# EAGLE design homecomputer-6502 (EAGLE 6.5.0)
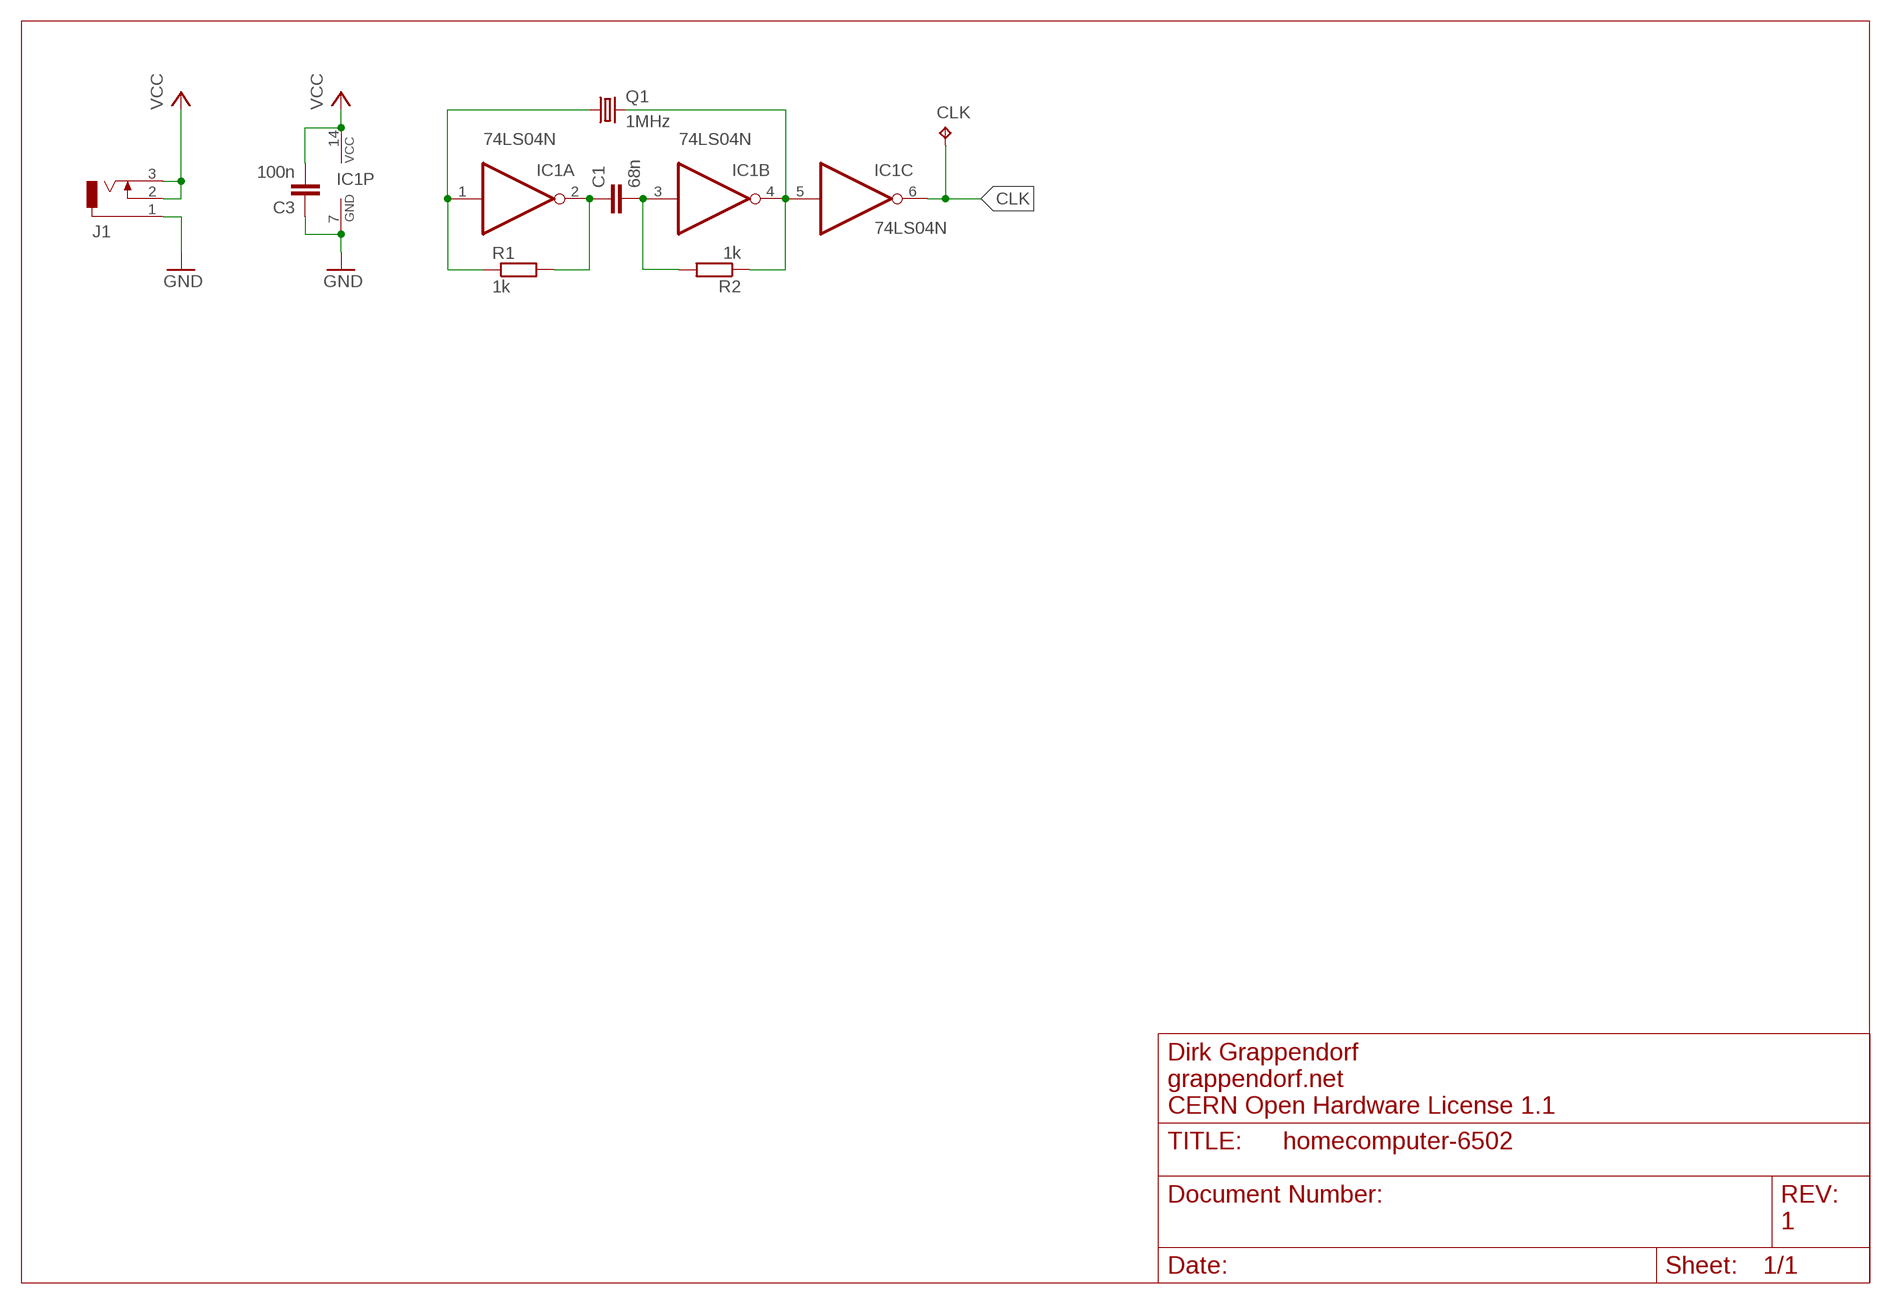
[diagram p0: schematic, sheet 1]

## Parts
C1  68n  C-EU025-024X044  [C025-024X044]
C3  100n  C-EU025-024X044  [C025-024X044]
CLK  TPTP15SQ  [TP15SQ]
IC1  74LS04N  [DIL14]
J1  DCJ0303  [DCJ0303]
Q1  1MHz  CRYSTALHC49U-V  [HC49U-V]
R1  1k  R-EU_0204/5  [0204/5]
R2  1k  R-EU_0204/5  [0204/5]

## Nets
CLK: CLK.TP IC1.6(C:O)
GND: C3.1 IC1.7(P:GND) J1.1
N$1: IC1.1(A:I) Q1.1 R1.1
N$2: C1.1 IC1.2(A:O) R1.2
N$7: C1.2 IC1.3(B:I) R2.2
N$8: IC1.4(B:O) IC1.5(C:I) Q1.2 R2.1
VCC: C3.2 IC1.14(P:VCC) J1.2 J1.3
Unconnected: IC1.8(D:O) IC1.9(D:I) IC1.10(E:O) IC1.11(E:I) IC1.12(F:O) IC1.13(F:I)

## Notes on the sheet
- Dirk Grappendorf
- grappendorf.net
- CERN Open Hardware License 1.1
- 1

## Library data of the parts
C1 C3 = rcl:C-EU: CAPACITOR, European symbol
CLK = testpad:TP: Test pad
IC1 = 74xx-eu:74*04: Hex INVERTER
J1 = con-jack:DCJ0303: DC POWER JACK Source: DCJ0303.pdf; OC_FARNELL: unknown; OC_NEWARK: unknown
Q1 = crystal:CRYSTAL: CRYSTAL; OC_FARNELL: 1666969; OC_NEWARK: unknown
R1 R2 = rcl:R-EU_: RESISTOR, European symbol

## Board
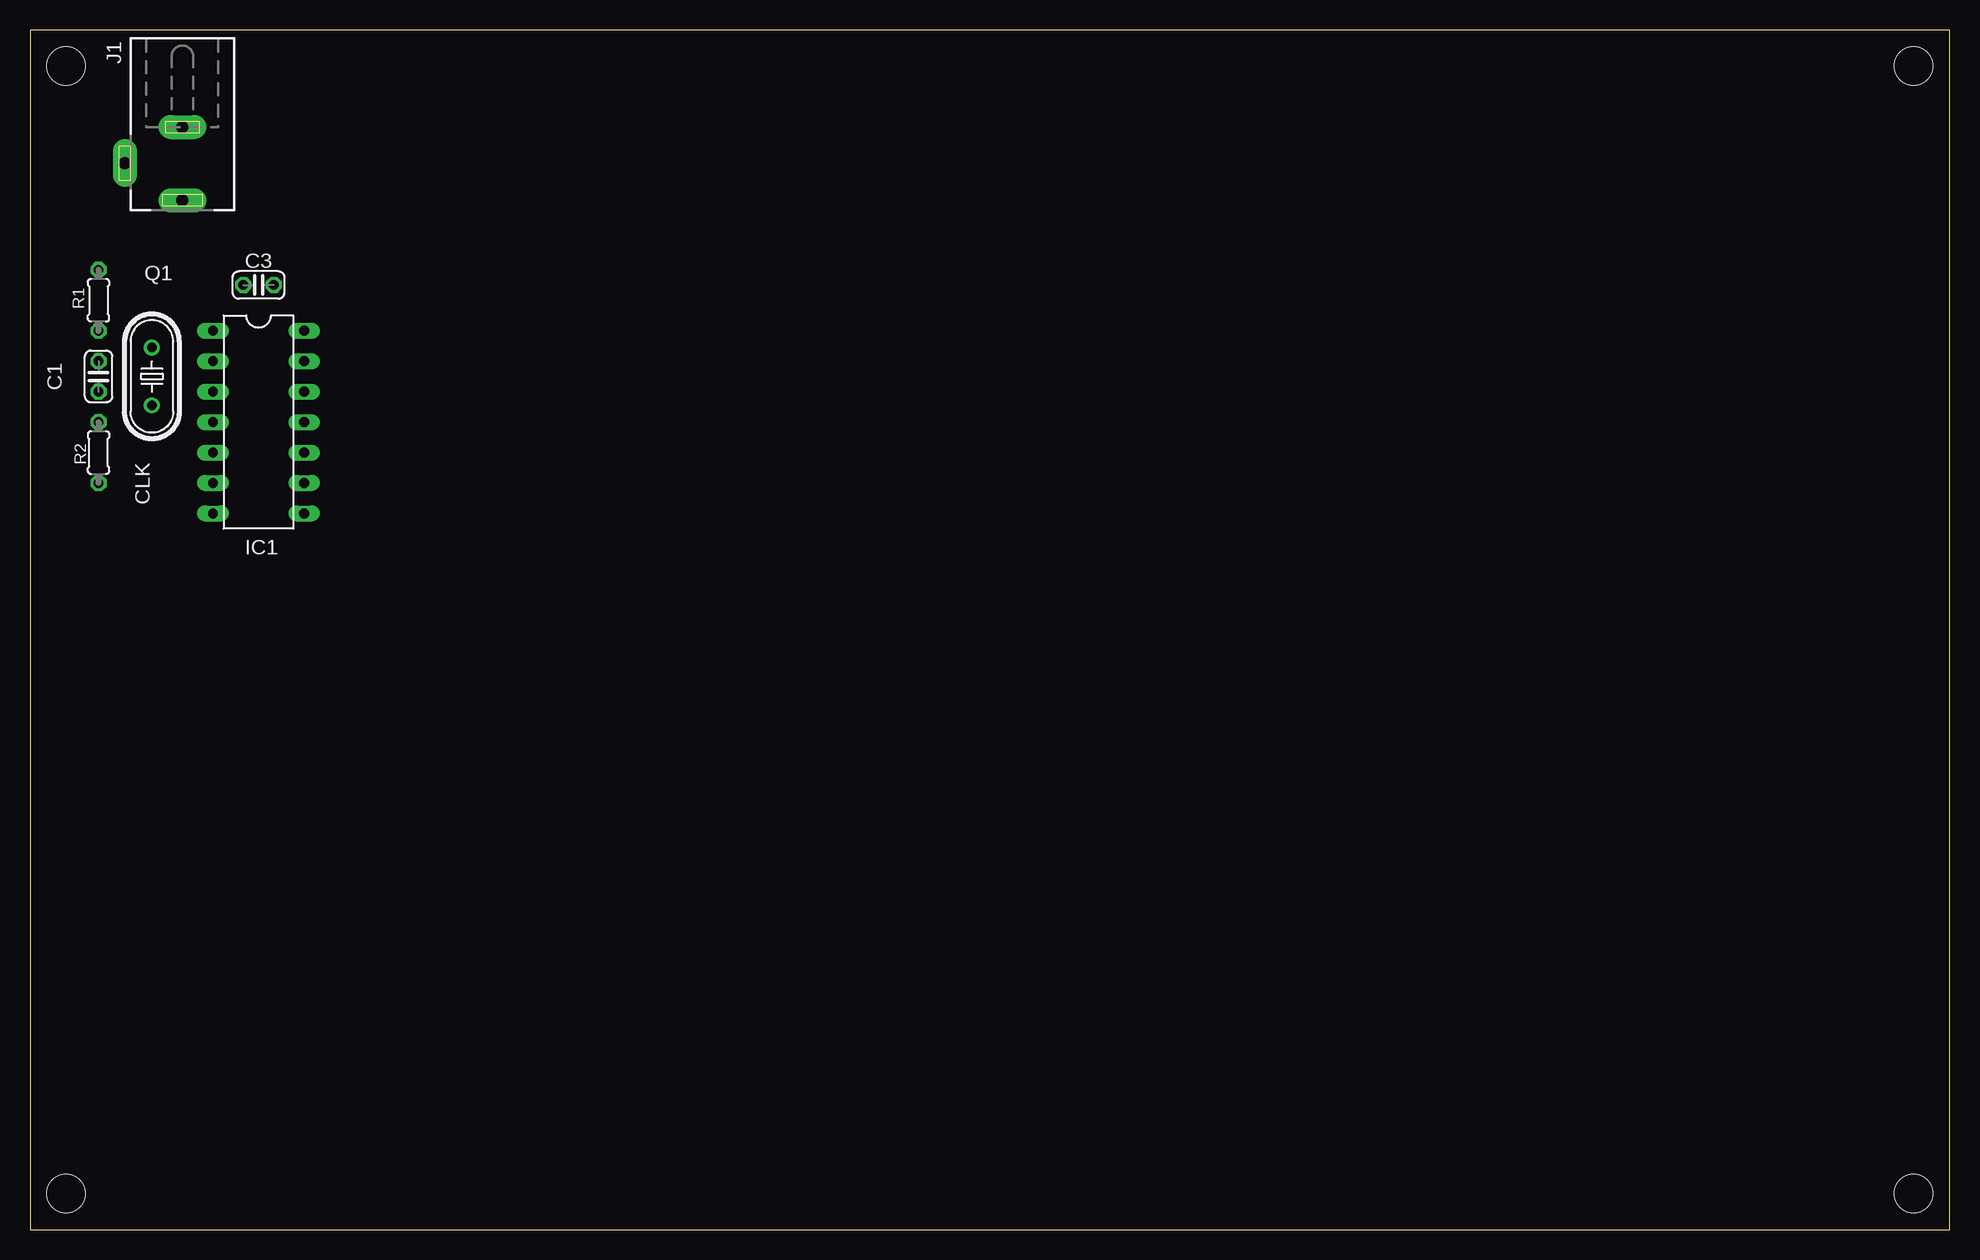
[diagram p1: board, top side]
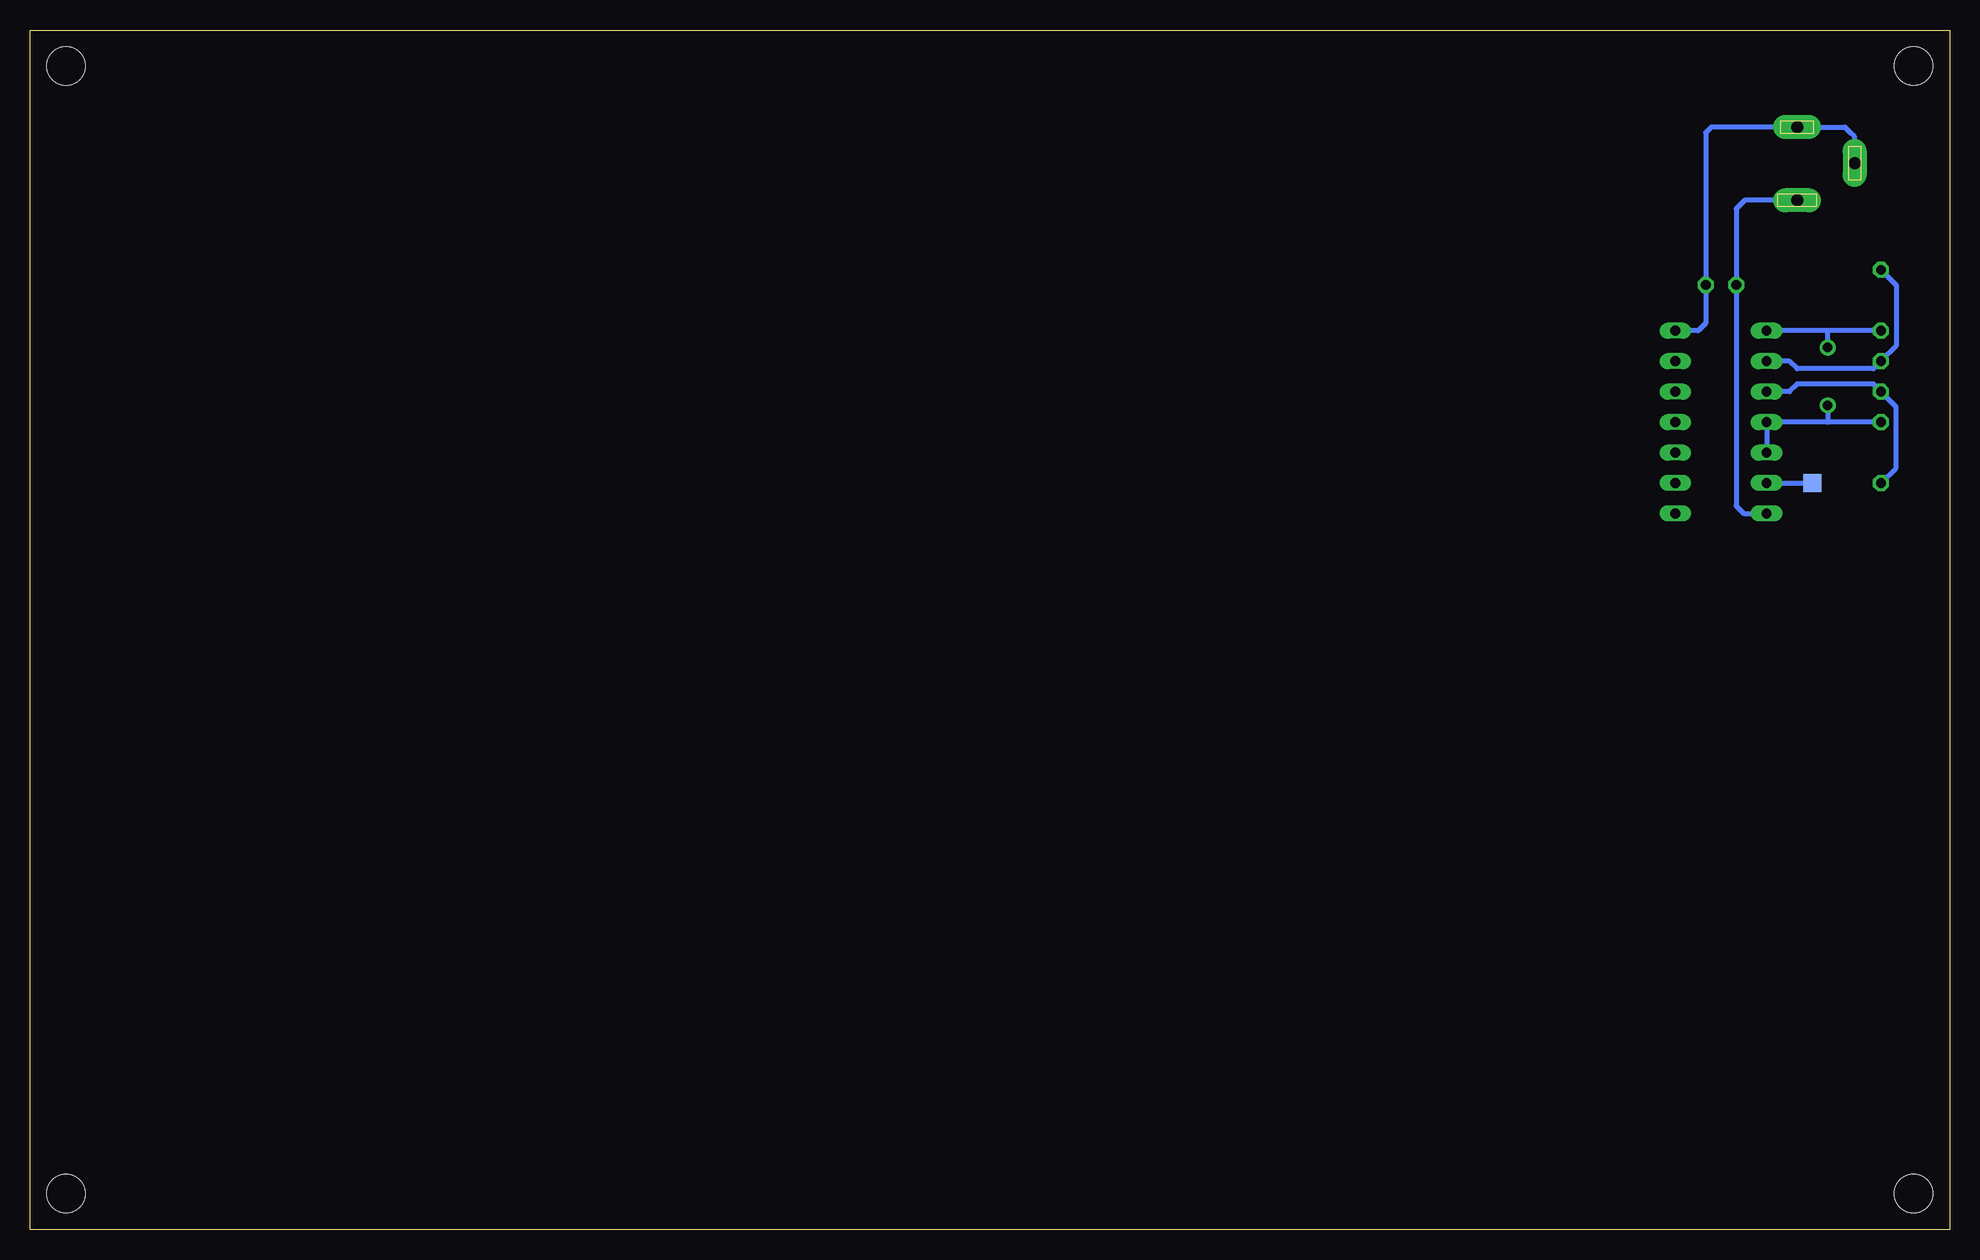
[diagram p2: board, bottom side, seen from below]

Size 160 x 100 mm. Coordinates in mm from the lower left corner, seen from the top.
Outline: 0,0 160,0 160,100 0,100 0,0
Copper layers (1*16): Top 0.035mm / dielectric 1.5mm / Bottom 0.035mm
Design rules "default": minimum track width 10mil, minimum drill 24mil, track to track 8mil, track to pad 8mil, pad to pad 8mil, via to via 8mil, smd to smd 8mil, copper to edge 40mil, drill to drill 8mil, minimum pad ring 10mil, minimum via ring 8mil, stop-mask expansion 4mil, vias tented up to drill 0mil, thermal gap 10mil
Holes 3.2 mm at 3,97 157,97 3,3 157,3

### Footprints (pad centres in the part's own frame; a part is rotated, then mirrored left to right if it is on the bottom)
C025-024X044 = drill 0.813 octagon: 1 -1.27,0; 2 1.27,0
TP15SQ = smd 1.5 x 1.5: TP 0,0
DIL14 = drill 0.813 long: 1 -7.62,-3.81; 2 -5.08,-3.81; 3 -2.54,-3.81; 4 0,-3.81; 5 2.54,-3.81; 6 5.08,-3.81; 7 7.62,-3.81; 8 7.62,3.81; 9 5.08,3.81; 10 2.54,3.81; 11 0,3.81; 12 -2.54,3.81; 13 -5.08,3.81; 14 -7.62,3.81
DCJ0303 = drill 1 pad 2 long: 1 0,3.1; 2 4.8,0; 3 0,-3
HC49U-V = drill 0.813: 1 -2.413,0; 2 2.413,0
0204/5 = drill 0.813 octagon: 1 -2.54,0; 2 2.54,0

### Placement (x,y rotation side)
C1  5.71,71.12 270 top
C3  19.05,78.74 0 top
CLK  11.43,62.23 0 bottom
IC1  19.05,67.31 270 top
J1  12.7,88.9 180 top
Q1  10.16,71.12 270 top
R1  5.71,77.47 90 top
R2  5.71,64.77 270 top

### Tracks (layer width: path | path; a pad name or v marks a point on that pad's centre or on a via)
CLK
  Bottom 0.406: IC1.6 CLK.TP
GND
  Bottom 0.406: IC1.7 17.14,59.69 17.78,60.33 C3.1 17.78,85.09 17.07,85.8 J1.1
N$1
  Bottom 0.406: R1.1 10.16,74.93 | 10.16,74.93 IC1.1 | Q1.1 10.16,74.93
N$2
  Bottom 0.406: IC1.2 13.34,72.39 12.7,71.75 6.35,71.75 C1.1 4.45,73.66 4.45,78.74 R1.2
N$7
  Bottom 0.406: IC1.3 13.34,69.85 12.7,70.48 6.35,70.48 C1.2 4.45,68.58 4.45,63.5 R2.2
N$8
  Bottom 0.406: IC1.5 IC1.4 10.16,67.31 | R2.1 10.16,67.31 | Q1.2 10.16,67.31
VCC
  Bottom 0.406: IC1.14 20.95,74.93 20.32,75.56 C3.2 20.32,91.44 19.86,91.9 J1.3 8.71,91.9 8.26,91.44 7.9,91.08 J1.2